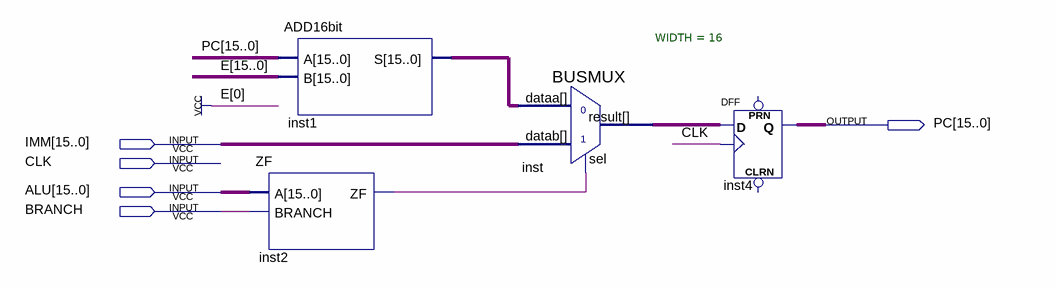
[diagram p0: schematic sheet]
// Quartus schematic PC.bdf as structural Verilog: 4 symbols, 5 pins
module PC (
  input  [15:0] IMM,
  input  CLK,
  input  [15:0] ALU,
  input  BRANCH,
  output [15:0] PC
);

  wire inst2_zf;
  wire [15:0] inst1_s, inst_result;
  wire [15:1] E;

  ADD16bit inst1 (.A(PC), .B({E, 1'b1}), .S(inst1_s));
  ZF inst2 (.A(ALU), .BRANCH(BRANCH), .ZF(inst2_zf));
  BUSMUX #(.WIDTH(16)) inst (.datab(IMM), .sel(inst2_zf), .dataa(inst1_s), .result(inst_result));
  DFF inst4[15:0] (.CLK(CLK), .D(inst_result), .Q(PC));  // open: CLRN, PRN
endmodule
